# Altium schematic sheet HUB.SchDoc
size 508 x 381 mm; SheetNumber: 1; SheetTotal: 1
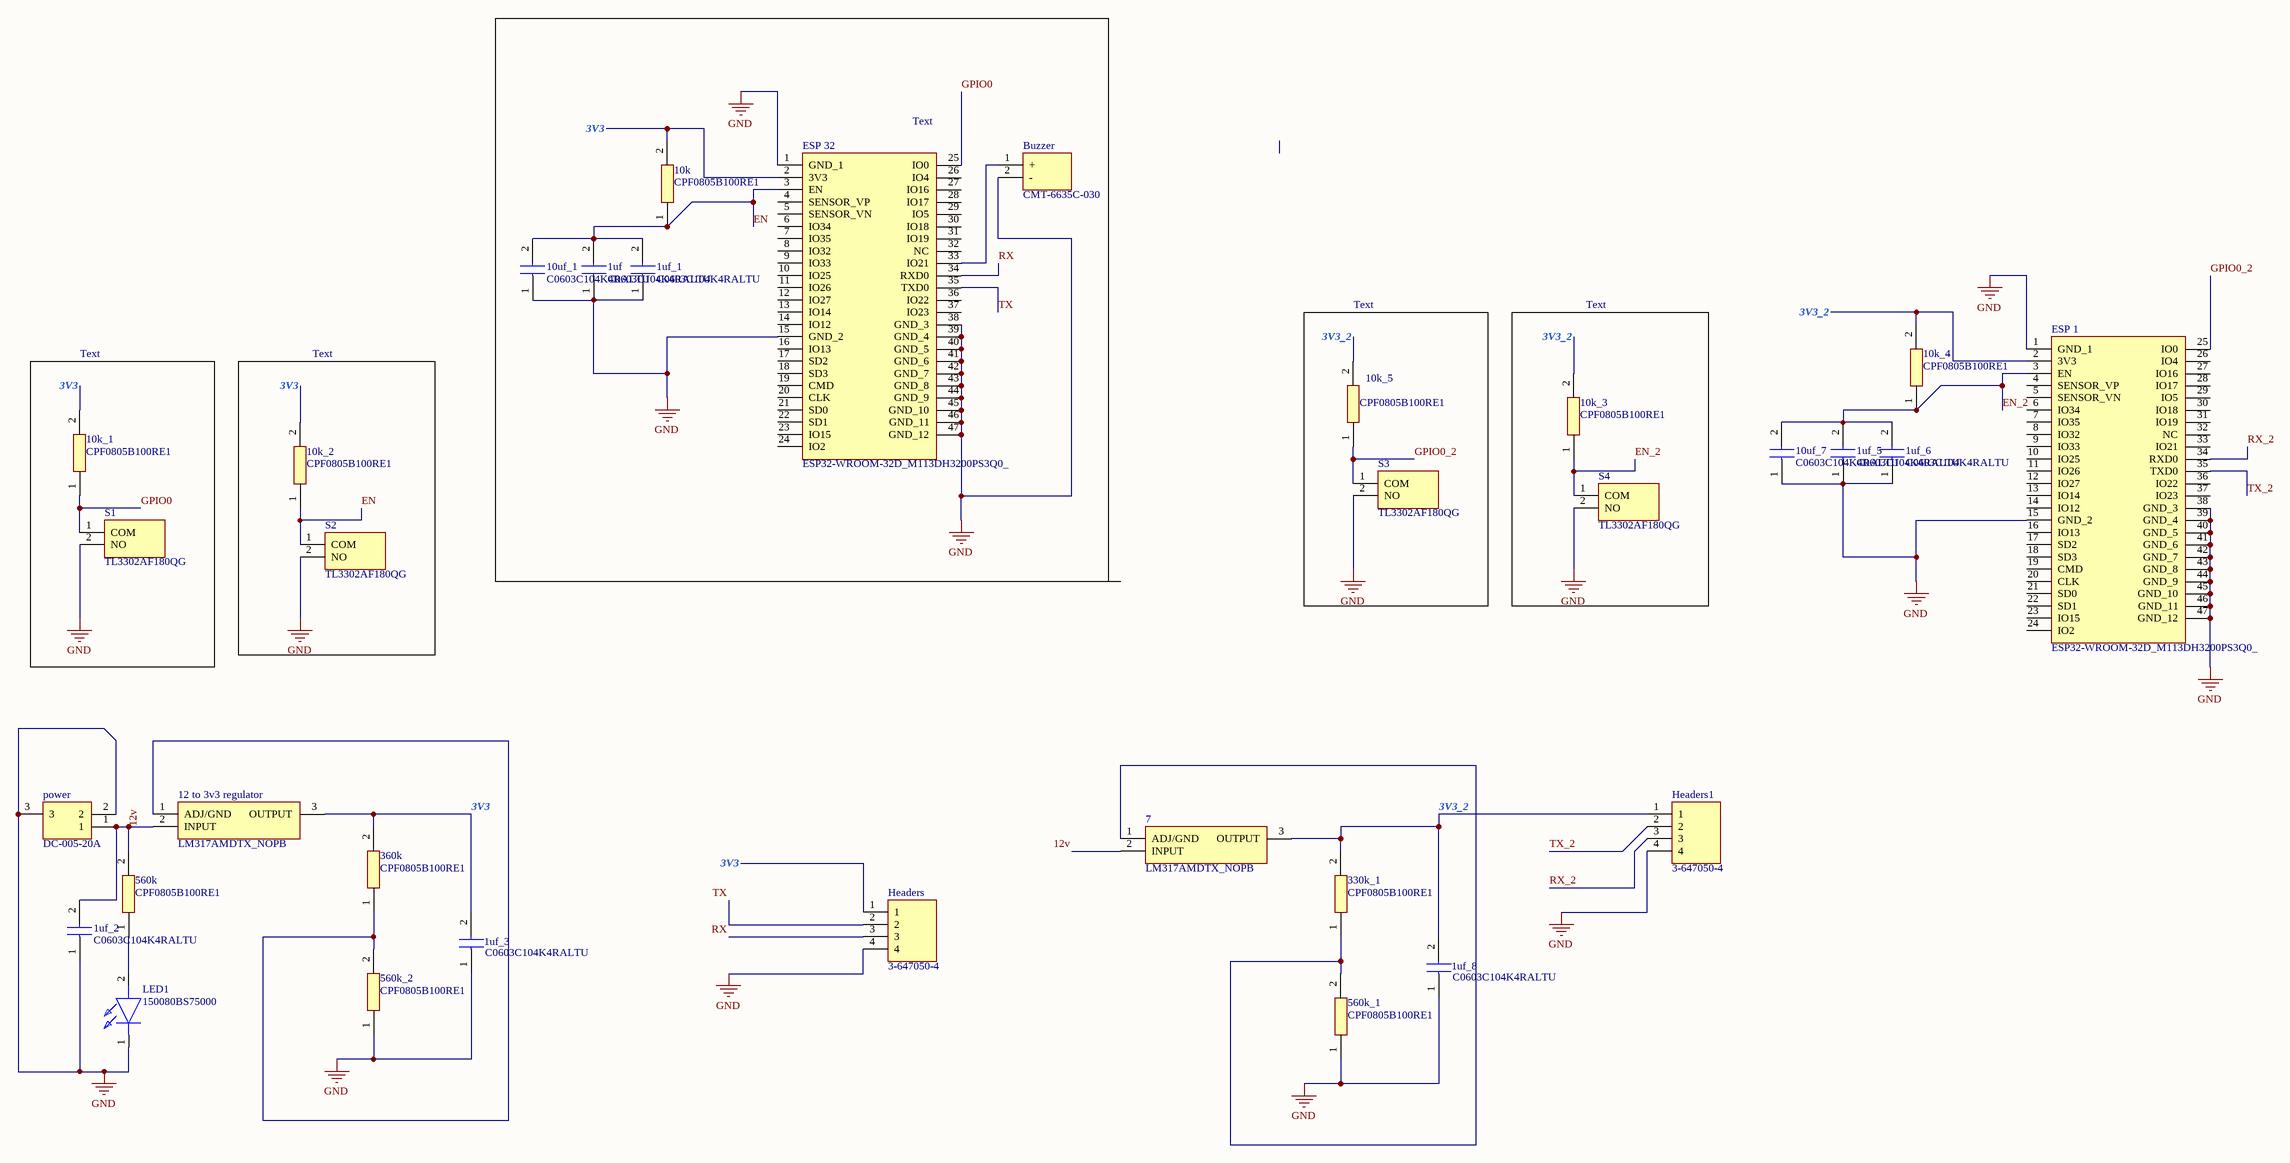
[diagram p0: HUB.SchDoc]

## Parts
1uf  C0603C104K4RALTU  [C0603]
1uf_1  C0603C104K4RALTU  [C0603]
1uf_2  C0603C104K4RALTU  [C0603]
1uf_3  C0603C104K4RALTU  [C0603]
1uf_5  C0603C104K4RALTU  [C0603]
1uf_6  C0603C104K4RALTU  [C0603]
1uf_8  C0603C104K4RALTU  [C0603]
7  LM317AMDTX_NOPB  [LM78M05CDT]
10k  CPF0805B100RE1  [RESC2012X65N]
10k_1  CPF0805B100RE1  [RESC2012X65N]
10k_2  CPF0805B100RE1  [RESC2012X65N]
10k_3  CPF0805B100RE1  [RESC2012X65N]
10k_4  CPF0805B100RE1  [RESC2012X65N]
10k_5  CPF0805B100RE1  [RESC2012X65N]
10uf_1  C0603C104K4RALTU  [C0603]
10uf_7  C0603C104K4RALTU  [C0603]
12_to_3v3_regulator  LM317AMDTX_NOPB  [LM78M05CDT]
330k_1  CPF0805B100RE1  [RESC2012X65N]
360k  CPF0805B100RE1  [RESC2012X65N]
560k  CPF0805B100RE1  [RESC2012X65N]
560k_1  CPF0805B100RE1  [RESC2012X65N]
560k_2  CPF0805B100RE1  [RESC2012X65N]
Buzzer  CMT-6635C-030  [CMT6635C030]
ESP_1  ESP32-WROOM-32D_M113DH3200PS3Q0_  [ESP32WROOM32DM113DH3200PS3Q0]
ESP_32  ESP32-WROOM-32D_M113DH3200PS3Q0_  [ESP32WROOM32DM113DH3200PS3Q0]
Headers  3-647050-4  [SHDR4W66P0X254_1X4_1016X635X1079P]
Headers1  3-647050-4  [SHDR4W66P0X254_1X4_1016X635X1079P]
LED1  150080BS75000  [LEDC2012X80N]
power  DC-005-20A  [DC00520A]
S1  TL3302AF180QG  [TL3302AF180QG]
S2  TL3302AF180QG  [TL3302AF180QG]
S3  TL3302AF180QG  [TL3302AF180QG]
S4  TL3302AF180QG  [TL3302AF180QG]

## Blocks framed on the sheet
Text: 10k_5 S3
Text: 10k_3 S4
Text: 10k_1 S1
Text: 10k_2 S2

## Nets
GND: 1uf.1 1uf_1.1 1uf_2.1 1uf_3.1 1uf_5.1 1uf_6.1 1uf_8.1 10uf_1.1 10uf_7.1 560k_1.1 560k_2.1 Buzzer.2(-) ESP_1.1(GND_1) ESP_1.15(GND_2) ESP_1.38(GND_3) ESP_1.39(GND_4) ESP_1.40(GND_5) ESP_1.41(GND_6) ESP_1.42(GND_7) ESP_1.43(GND_8) ESP_1.44(GND_9) ESP_1.45(GND_10) ESP_1.46(GND_11) ESP_1.47(GND_12) ESP_32.1(GND_1) ESP_32.15(GND_2) ESP_32.38(GND_3) ESP_32.39(GND_4) ESP_32.40(GND_5) ESP_32.41(GND_6) ESP_32.42(GND_7) ESP_32.43(GND_8) ESP_32.44(GND_9) ESP_32.45(GND_10) ESP_32.46(GND_11) ESP_32.47(GND_12) Headers.4 Headers1.4 LED1.1(K) power.2 power.3 S1.2(NO) S2.2(NO) S3.2(NO) S4.2(NO)
3V3: 1uf_3.2 10k.2 10k_1.2 10k_2.2 12_to_3v3_regulator.3(OUTPUT) 360k.2 ESP_32.2(3V3) Headers.1
3V3_2: 1uf_8.2 7.3(OUTPUT) 10k_3.2 10k_4.2 10k_5.2 330k_1.2 ESP_1.2(3V3) Headers1.1
12v: 1uf_2.2 7.2(INPUT) 12_to_3v3_regulator.2(INPUT) 560k.2 power.1
EN: 1uf.2 1uf_1.2 10k.1 10k_2.1 10uf_1.2 ESP_32.3(EN) S2.1(COM)
EN_2: 1uf_5.2 1uf_6.2 10k_3.1 10k_4.1 10uf_7.2 ESP_1.3(EN) S4.1(COM)
GPIO0: 10k_1.1 ESP_32.25(IO0) S1.1(COM)
GPIO0_2: 10k_5.1 ESP_1.25(IO0) S3.1(COM)
RX: ESP_32.34(RXD0) Headers.3
RX_2: ESP_1.34(RXD0) Headers1.3
TX: ESP_32.35(TXD0) Headers.2
TX_2: ESP_1.35(TXD0) Headers1.2
Net7_1: 7.1(ADJ/GND) 330k_1.1 560k_1.2
Net12_to_3v3_regulator_1: 12_to_3v3_regulator.1(ADJ/GND) 360k.1 560k_2.2
Net560k_1: 560k.1 LED1.2(A)
NetBuzzer_1: Buzzer.1(+) ESP_32.33(IO21)

Not connected (* = marked no-connect by the designer): ESP_1 4(SENSOR_VP) 5(SENSOR_VN) 6(IO34) 7(IO35) 8(IO32) 9(IO33) 10(IO25) 11(IO26) 12(IO27) 13(IO14) 14(IO12) 16(IO13) 17(SD2) 18(SD3) 19(CMD) 20(CLK) 21(SD0) 22(SD1) 23(IO15) 24(IO2) 26(IO4) 27(IO16) 28(IO17) 29(IO5) 30(IO18) 31(IO19) 32(NC) 33(IO21) 36(IO22) 37(IO23); ESP_32 4(SENSOR_VP) 5(SENSOR_VN) 6(IO34) 7(IO35) 8(IO32) 9(IO33) 10(IO25) 11(IO26) 12(IO27) 13(IO14) 14(IO12) 16(IO13) 17(SD2) 18(SD3) 19(CMD) 20(CLK) 21(SD0) 22(SD1) 23(IO15) 24(IO2) 26(IO4) 27(IO16) 28(IO17) 29(IO5) 30(IO18) 31(IO19) 32(NC) 36(IO22) 37(IO23)

## Notes on the sheet
- (near ESP_32) Text

## Library data of the parts
1uf 1uf_1-1uf_3 1uf_5 1uf_6 1uf_8 10uf_1 10uf_7 = C0603C104K4RALTU: Capacitor; Manufacturer_Name: KEMET; Datasheet Link: https://content.kemet.com/datasheets/KEM_C1018_X7R_SnPb_SMD.pdf; Height: 0.87mm; Manufacturer_Part_Number: C0603C104K4RALTU; Mouser Part Number: 80-C0603C104K4RAL; Mouser Price/Stock: https://www.mouser.co.uk/ProductDetail/KEMET/C0603C104K4RALTU?qs=Av9gTi0A7zOg0Qy3fuNTKg%3D%3D; Arrow Part Number: C0603C104K4RALTU; Arrow Price/Stock: https://www.arrow.com/en/products/c0603c104k4raltu/kemet-corporation
7 12_to_3v3_regulator = LM317AMDTX_NOPB: Integrated Circuit; Manufacturer_Name: Texas Instruments; Manufacturer_Part_Number: LM317AMDTX/NOPB; Datasheet Link: http://www.ti.com/lit/gpn/lm317a; Mouser Part Number: 926-LM317AMDTX/NOPB; Mouser Price/Stock: https://www.mouser.co.uk/ProductDetail/Texas-Instruments/LM317AMDTX-NOPB?qs=X1J7HmVL2ZE2tJdeke3r6w%3D%3D; Arrow Part Number: LM317AMDTX/NOPB; Arrow Price/Stock: https://www.arrow.com/en/products/lm317amdtxnopb/texas-instruments
10k 10k_1-10k_5 330k_1 360k 560k 560k_1 560k_2 = CPF0805B100RE1: Resistor; Manufacturer_Name: TE Connectivity; Datasheet Link: http://docs-europe.electrocomponents.com/webdocs/13d1/0900766b813d116f.pdf; Height: 0.65mm; Manufacturer_Part_Number: CPF0805B100RE1; Mouser Part Number: 279-CPF0805B100RE1; Mouser Price/Stock: https://www.mouser.co.uk/ProductDetail/TE-Connectivity-Holsworthy/CPF0805B100RE1?qs=9ylKvqdyudkCWLPT1QvLZQ%3D%3D; Arrow Part Number: CPF0805B100RE1; Arrow Price/Stock: https://www.arrow.com/en/products/cpf0805b100re1/te-connectivity?region=nac
Buzzer = CMT-6635C-030: Undefined or Miscellaneous; Manufacturer_Name: CUI Devices; Datasheet Link: https://www.cuidevices.com/product/resource/cmt-6635c-030.pdf; Height: 4mm; Manufacturer_Part_Number: CMT-6635C-030; Mouser Part Number: 490-CMT-6635C-030; Mouser Price/Stock: https://www.mouser.co.uk/ProductDetail/CUI-Devices/CMT-6635C-030?qs=qCxwlXJ4fnxPFuZxoalErQ%3D%3D
ESP_1 ESP_32 = ESP32-WROOM-32D_M113DH3200PS3Q0_: Integrated Circuit; Manufacturer_Name: Espressif Systems; Manufacturer_Part_Number: ESP32-WROOM-32D(M113DH3200PS3Q0); Datasheet Link: https://componentsearchengine.com/Datasheets/1/ESP32-WROOM-32D(M113DH3200PS3Q0).pdf; Height: 3.2mm; Mouser Part Number: 356-ESPWROOM3200PS3; Mouser Price/Stock: https://www.mouser.co.uk/ProductDetail/Espressif-Systems/ESP32-WROOM-32DM113DH3200PS3Q0?qs=wnTfsH77Xs7iNQbBNob0RQ%3D%3D
Headers Headers1 = 3-647050-4: Connector; Manufacturer_Name: TE Connectivity; Datasheet Link: https://www.te.com/commerce/DocumentDelivery/DDEController?Action=showdoc&DocId=Customer+Drawing%7F647050%7FU%7Fpdf%7FEnglish%7FENG_CD_647050_U.pdf%7F3-647050-4; Height: 10.79mm; Manufacturer_Part_Number: 3-647050-4; Mouser Part Number: 571-3-647050-4; Mouser Price/Stock: https://www.mouser.co.uk/ProductDetail/TE-Connectivity-AMP/3-647050-4?qs=W5ux9j661SoBsMK9vpa9%252BQ%3D%3D; Arrow Part Number: 3-647050-4; Arrow Price/Stock: https://www.arrow.com/en/products/3-647050-4/te-connectivity?region=nac
LED1 = 150080BS75000: LED; Manufacturer_Name: Wurth Elektronik; Datasheet Link: https://katalog.we-online.com/led/datasheet/150080BS75000.pdf; Height: 0.8mm; Manufacturer_Part_Number: 150080BS75000; Mouser Part Number: 710-150080BS75000; Mouser Price/Stock: https://www.mouser.co.uk/ProductDetail/Wurth-Elektronik/150080BS75000?qs=2kOmHSv6VfT2tBo3UPVqAQ%3D%3D
power = DC-005-20A: Connector; Manufacturer_Name: Korean Hroparts Elec; Datasheet Link: https://datasheet.lcsc.com/szlcsc/Korean-Hroparts-Elec-DC-005-20A_C130239.pdf; Height: 11mm; Manufacturer_Part_Number: DC-005-20A
S1-S4 = TL3302AF180QG: Switch; Manufacturer_Name: E-Switch; Datasheet Link: https://componentsearchengine.com/Datasheets/2/TL3302AF180QG.pdf; Height: 5mm; Manufacturer_Part_Number: TL3302AF180QG; Mouser Part Number: 612-TL3302A; Mouser Price/Stock: https://www.mouser.co.uk/ProductDetail/E-Switch/TL3302AF180QG?qs=HKd%2Fp3M7KlXmC8e3lU%2FDFQ%3D%3D